# Altium schematic sheet DC DC.SchDoc
size 297 x 209 mm; CompanyName: Sainsbury Wellcome Centre; Organization: FabLab; Address1: Sainsbury Wellcome Centre; Address2: 25 Howland Street; Address3: London; Address4: W1T 4JG; DocumentNumber: 4; SheetNumber: 4; SheetTotal: 12; swcgroup: FabLab; Org: Sainsbury Wellcome Centre; Add1: 25 Howland Street; Add2: London; Add3: W1T 4JG; WebAddress: www.sainsburywellcome.org; SheetSize: A4; SheetName: Level Shifter
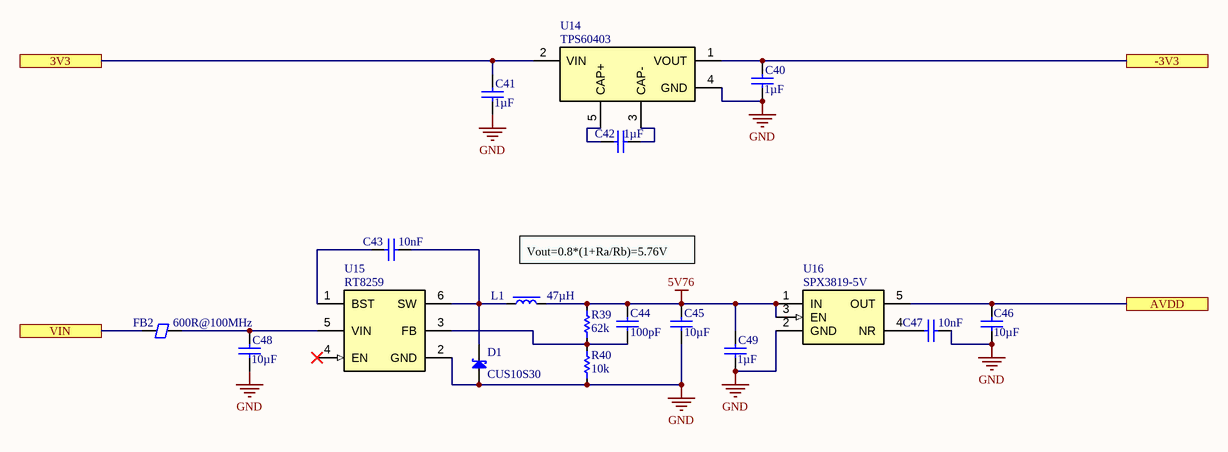
[diagram p0: DC DC.SchDoc]

## Parts
C40  value 1µF  [CAP_CHIP_0603]  (hidden comment: C0603-1uF-50V)
C41  value 1µF  [CAP_CHIP_0603]  (hidden comment: C0603-1uF-50V)
C42  value 1µF  [CAP_CHIP_0603]  (hidden comment: C0603-1uF-50V)
C43  value 10nF  [CAP_CHIP_0603]  (hidden comment: C0603-10nF-50V)
C44  value 100pF  [CAP_CHIP_0603]  (hidden comment: C0603-100pF-50V)
C45  value 10µF  [CAP_CHIP_0603]  (hidden comment: C0603-10uF-35V)
C46  value 10µF  [CAP_CHIP_0603]  (hidden comment: C0603-10uF-25V)
C47  value 10nF  [CAP_CHIP_0603]  (hidden comment: C0603-10nF-50V)
C48  value 10µF  [CAP_CHIP_0603]  (hidden comment: C0603-10uF-35V)
C49  value 1µF  [CAP_CHIP_0603]  (hidden comment: C0603-1uF-50V)
D1  CUS10S30  [SOD323]
FB2  value 600R@100MHz  [FB_CHIP_0805]  (hidden comment: FB0805-600R-0.5A)
L1  value 47µH  [IND_PWR_1210]  (hidden comment: L-PWR-47uH-0.3A)
R39  value 62k  [RES_CHIP_0603]  (hidden comment: R0603-62K)
R40  value 10k  [RES_CHIP_0603]  (hidden comment: R0603-10K)
U14  TPS60403  [SOT23-5]
U15  RT8259  [SOT23-6]
U16  SPX3819-5V  [SOT23-5]

## Ports
3V3, -3V3, AVDD, VIN

## Nets
5V76: C44.2 C45.2 C49.1 L1.2 R39.2 U16.1(IN) U16.3(EN)
GND: C40.2 C41.2 C45.1 C46.1 C47.1 C48.1 C49.2 D1.2(A) R40.1 U14.4(GND) U15.2(GND) U16.2(GND)
3V3: C41.1 U14.2(VIN) ; port 3V3
-3V3: C40.1 U14.1(VOUT) ; port -3V3
AVDD: C46.2 U16.5(OUT) ; port AVDD
VIN: FB2.1 ; port VIN
NetC42_1: C42.1 U14.5(CAP+)
NetC42_2: C42.2 U14.3(CAP-)
NetC43_1: C43.1 D1.1(C) L1.1 U15.6(SW)
NetC43_2: C43.2 U15.1(BST)
NetC44_1: C44.1 R39.1 R40.2 U15.3(FB)
NetC47_2: C47.2 U16.4(NR)
NetC48_2: C48.2 FB2.2 U15.5(VIN)

Not connected (* = marked no-connect by the designer): U15 4(EN)*

## Notes on the sheet
- Vout=0.8*(1+Ra/Rb)=5.76V
- FILE
- VARIANT
- DATE
- REVISION
- SHEET
- /
- PROJECT
- SIZE

## Library data of the parts
C40-C42 C49 = CMP-611-0033-11: 0603 Multilayer Ceramic Capacitors MLCC; PartNumber: CL10A105KB8NNNC; Pick&PlaceFootprint: C0603; Voltage Rating: 50V; Dielectric: X5R; Tolerance: 10%; Case/Package: 0603; LCSC Part N.: C15849; RoHS: Yes; Mount: SMD; Capacitor Type: Ceramic
C43 C47 = CMP-611-0022-7: 0603 Multilayer Ceramic Capacitors MLCC; PartNumber: 0603B103K500NT; Tolerance: 10%; Voltage Rating: 50V; Pick&PlaceFootprint: C0603; Dielectric: X7R; RoHS: Yes; Capacitor Type: Ceramic; Mount: SMD; Case/Package: 0603; LCSC Part N.: C57112
C44 = CMP-611-0038-6: 0603 Multilayer Ceramic Capacitors MLCC; PartNumber: CL10C101JB8NNNC; Pick&PlaceFootprint: C0603; Tolerance: 5%; Voltage Rating: 50V; Dielectric: C0G; Case/Package: 0603; LCSC Part N.: C14858; Capacitor Type: Ceramic; Mount: SMD; RoHS: Yes
C45 C48 = CMP-611-0048-3: Ceramic Capacitor, Multilayer, Ceramic, 35V, 20% +Tol, 20% -Tol, X5R, 15% TC, 10uF, Surface Mount, 0603; PartNumber: GRM188R6YA106MA73D; Pick&PlaceFootprint: C0603; Dielectric: X5R; Capacitor Type: Ceramic; Mount: SMD; LCSC Part N.: C194427; RoHS: Yes; Tolerance: 20%; Voltage Rating: 35V; Case/Package: 0603
C46 = CMP-611-0050-6: 0603 Multilayer Ceramic Capacitors MLCC; PartNumber: CL10A106MA8NRNC; Dielectric: X5R; Pick&PlaceFootprint: C0603; Voltage Rating: 25V; Tolerance: 20%; Case/Package: 0603; LCSC Part N.: C96446; RoHS: Yes; Capacitor Type: Ceramic; Mount: SMD
D1 = CMP-821-0013-3: Rectifier Diode, Schottky, 1 Phase, 1 Element, 1A, 30V V(RRM), Silicon; PartNumber: CUS10S30,H3F; Forward Voltage: 370mV; LCSC Part N.: C146335; Max Reverse Voltage: 30V; Mount: Surface Mount; Pick&PlaceFootprint: SOD323; Forward Current: 1A
FB2 = CMP-600-0000-6: Ferrite Chip, 1 Function(s), 0.5A, 2 Pin(s); PartNumber: GZ2012D601TF; DC Resistance-Max: 300mR; Current Rating: 500mA; Footprint: 0805; LCSC Part N.: C1017
L1 = CMP-620-0005-6: Inductor Power Chip Shielded Wirewound 47uH 20% 1MHz Ferrite 0.5A 0.9Ohm DCR 1210 Automotive T/R; PartNumber: LQW32FT470M0HL; RMS Current (Irms): 500mA; Saturation Current: 300mA; DC Resistance (DCR): 900mR; Tolerance: 20%; LCSC Part N.: C907956
R39 = CMP-633-0150-1: 100mW Thick Film Resistors 75V ±100ppm/℃ ±1% 0603 Chip Resistor; PartNumber: 0603WAF6202T5E; Pick&PlaceFootprint: R0603; Number of Resistors: 1; Mount: Surface Mount; Power Rating: 100mW; Tolerance: 1%; Voltage Rating: 75V; Case/Package: 0603; LCSC Part N.: C23221
R40 = CMP-633-0002-26: 100mW Thick Film Resistors 75V ±100ppm/℃ ±1% 0603 Chip Resistor; PartNumber: 0603WAF1002T5E; Number of Resistors: 1; Pick&PlaceFootprint: R0603; Case/Package: 0603; Voltage Rating: 75V; Power Rating: 100mW; LCSC Part N.: C25804; Tolerance: 1%; Mount: Surface Mount
U14 = CMP-970-0067-1: 60mA Charge Pump Voltage Inverter with Fixed 250kHz Operation 5-SOT-23 -40 to 85; PartNumber: TPS60403DBVR; Min Output Voltage: -1.8V; Min Input Voltage: 1.8V; Max Input Voltage: 5.25V; Switcher Configuration: Charge Pump; LCSC Part N.: C11338; Max Output current: 60mA; Switching Frequency: 250kHz
U15 = CMP-970-0044-2: Step-down type Adjustable 800mV~15V 1.2A 4.5V~24V Switching Regulator/Controller; PartNumber: RT8259GJ6; Min Input Voltage: 4.5V; RDS(On): 300mR; Reference Voltage: 0.8V; Switcher Configuration: BUCK; Switching Frequency: 1.4MHz; Max Input Voltage: 24V; Max Output Voltage: 15V; LCSC Part N.: C425775; Pick&PlaceFootprint: SOT23-6; Max Output current: 1.2A
U16 = CMP-970-0066-1: 500mA 70dB Fixed 3.3V Positive electrode 16V LDO; PartNumber: SPX3819M5-L-5-0/TR; Accuracy: 1%; Max Output Current: 800mA; Min Input Voltage: 2.5V; Output Noise: 40uV; Load Regulation: 0.05%; Output Voltage: 5V; Dropout Voltage: 340mV; Quiescent Current: 8uA; Line Regulation: 0.04%; Max Supply Voltage: 16V; PSRR: 70dB; Max Input Voltage: 16V; Output Current: 500mA; LCSC Part N.: C13417; Output Type: Fixed; Pick&PlaceFootprint: SOT23-5